# Altium schematic sheet Breeze2 ESC V1.SchDoc
size A2
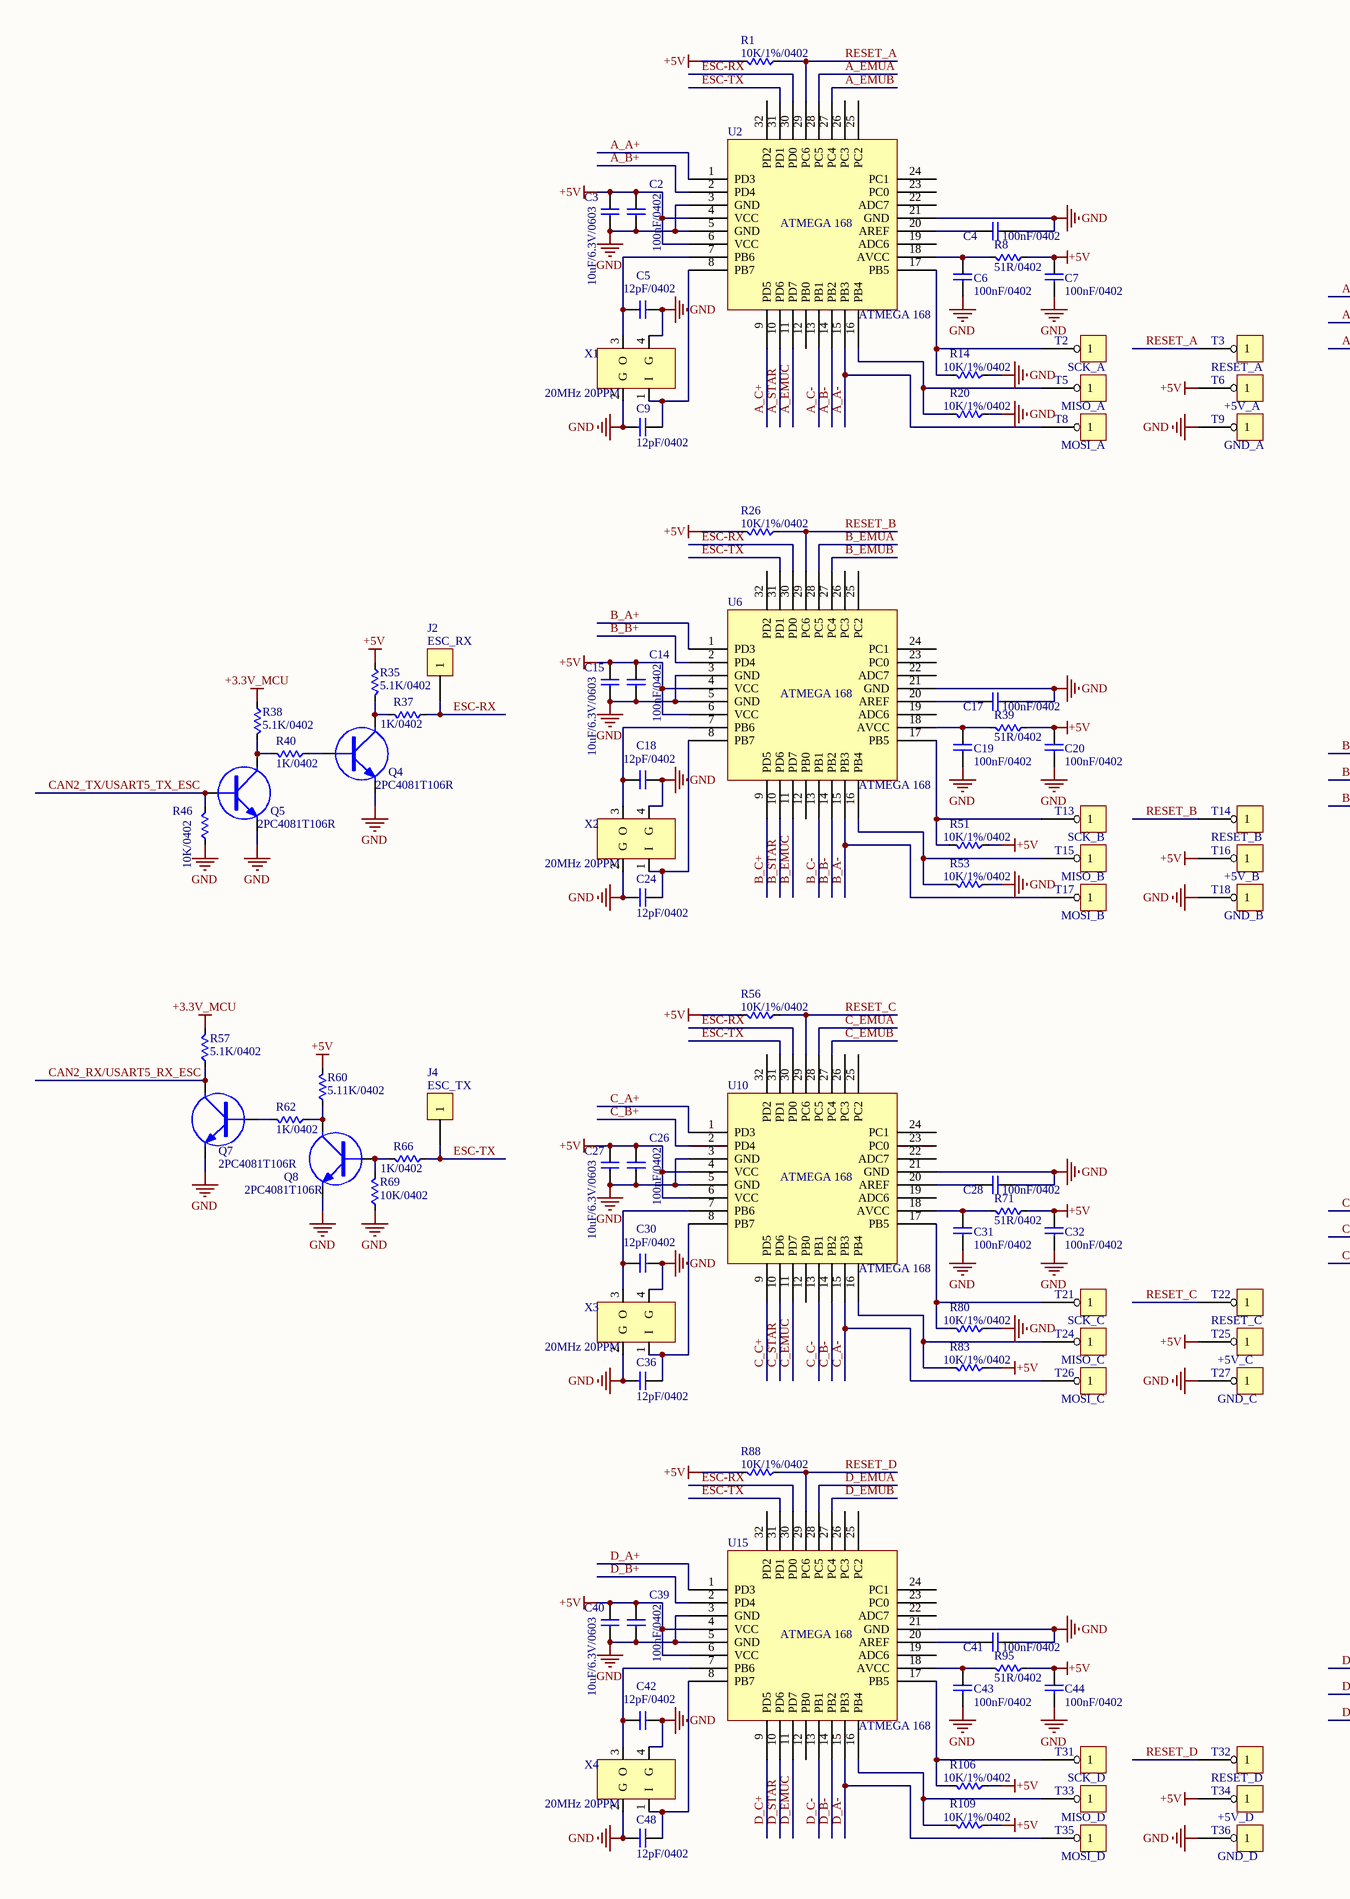
[diagram p0: Breeze2 ESC V1.SchDoc, left]
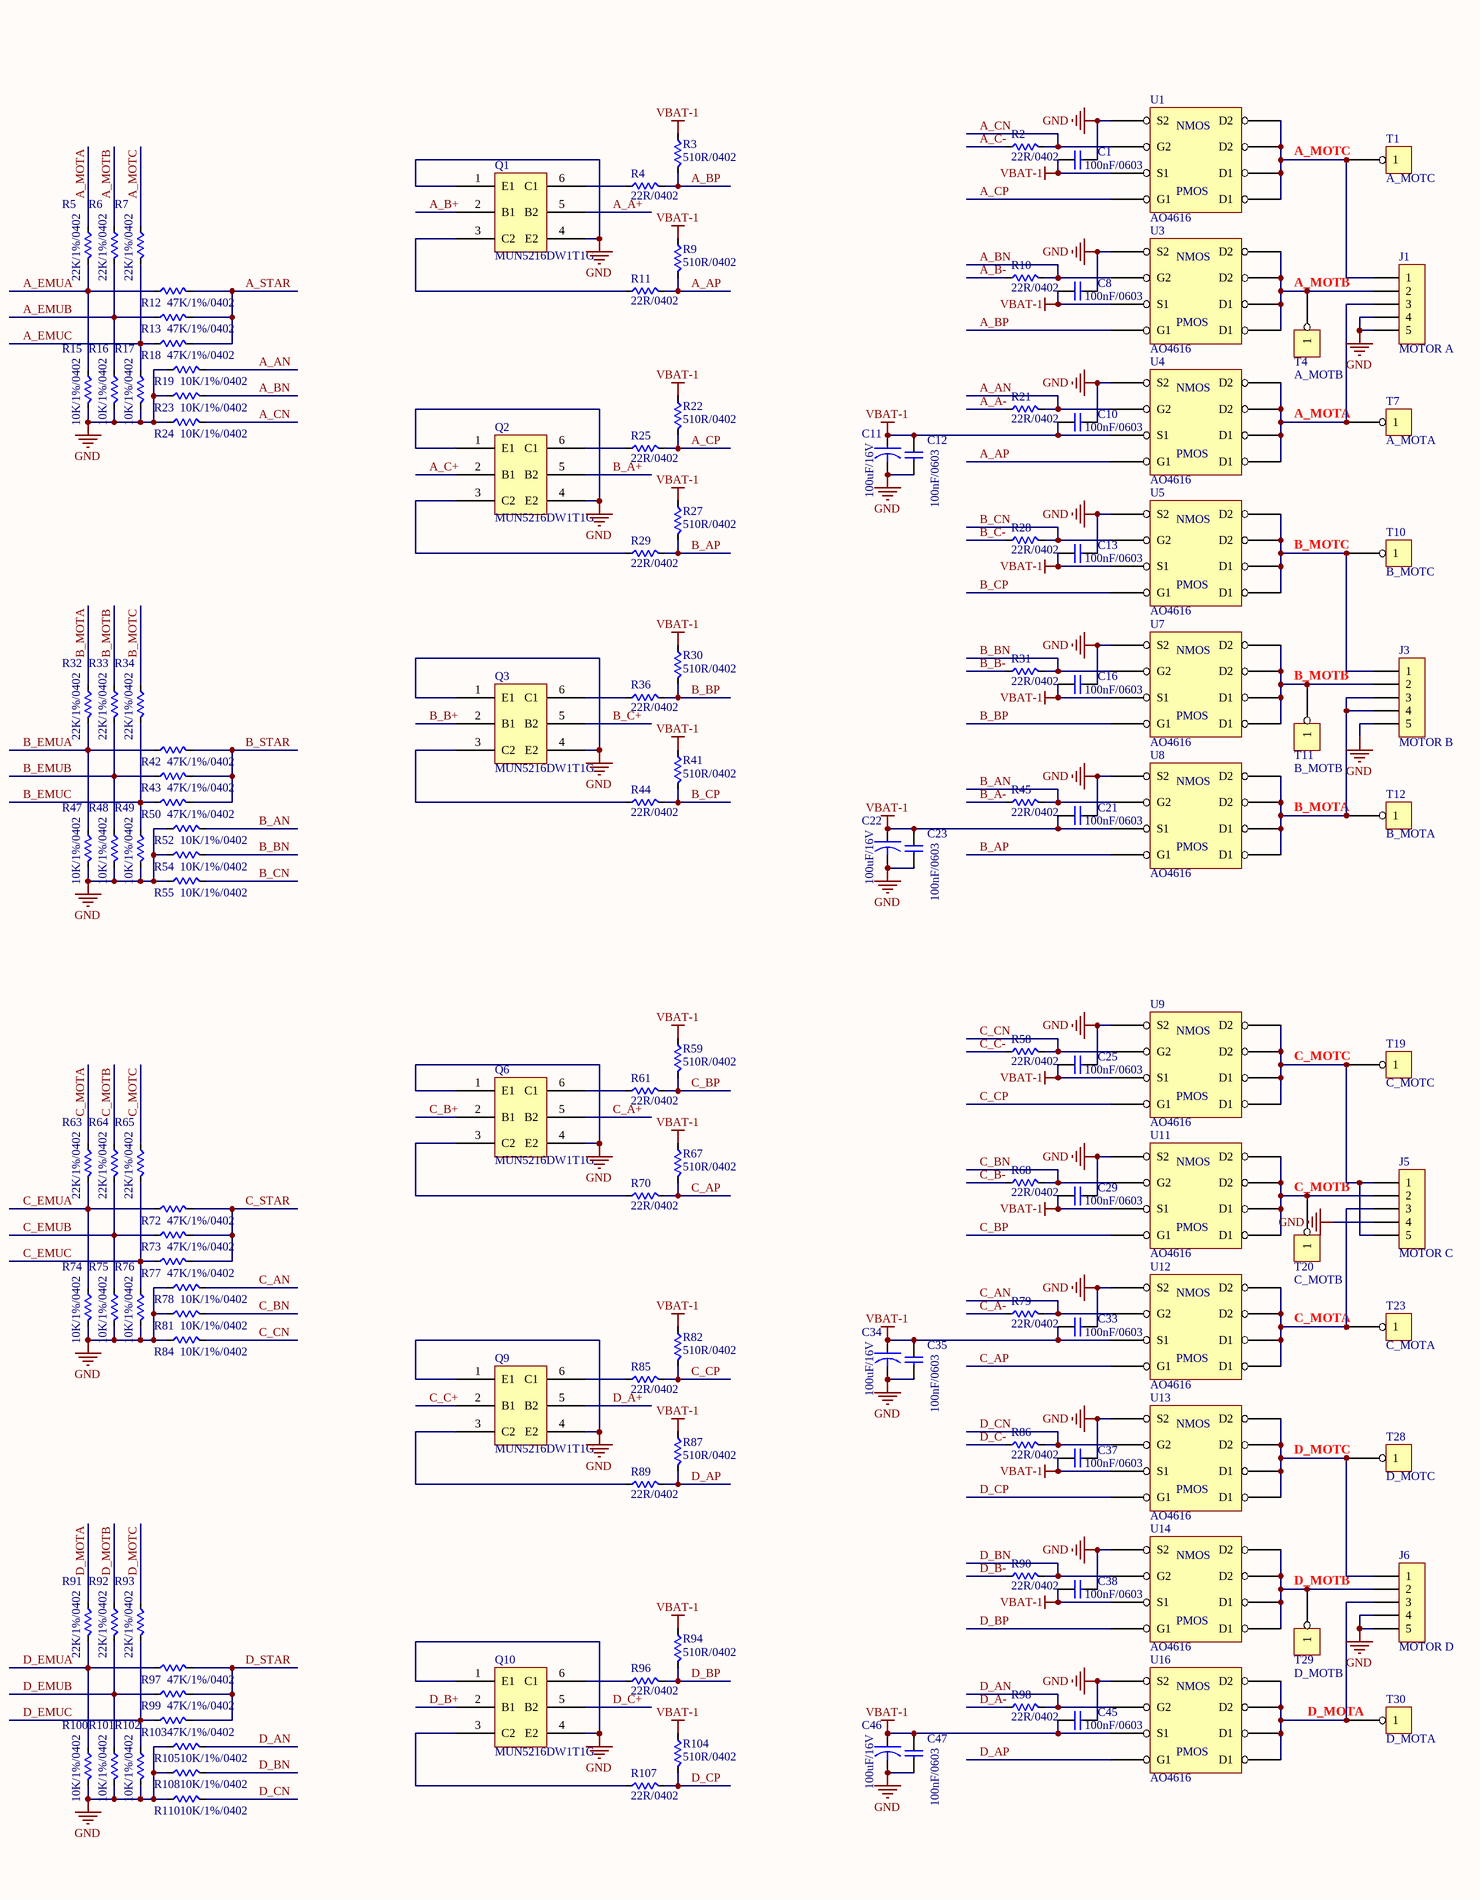
[diagram p1: Breeze2 ESC V1.SchDoc, right]

## Parts
C1  100nF/0603  [0603C-S]
C2  100nF/0402  [0402C-S]
C3  10uF/6.3V/0603  [0603C-S]
C4  100nF/0402  [0402C-S]
C5  12pF/0402  [0402C-S]
C6  100nF/0402  [0402C-S]
C7  100nF/0402  [0402C-S]
C8  100nF/0603  [0603C-S]
C9  12pF/0402  [0402C-S]
C10  100nF/0603  [0603C-S]
C11  100uF/16V  [1210C-S]
C12  100nF/0603  [0603C-S]
C13  100nF/0603  [0603C-S]
C14  100nF/0402  [0402C-S]
C15  10uF/6.3V/0603  [0603C-S]
C16  100nF/0603  [0603C-S]
C17  100nF/0402  [0402C-S]
C18  12pF/0402  [0402C-S]
C19  100nF/0402  [0402C-S]
C20  100nF/0402  [0402C-S]
C21  100nF/0603  [0603C-S]
C22  100uF/16V  [1210C-S]
C23  100nF/0603  [0603C-S]
C24  12pF/0402  [0402C-S]
C25  100nF/0603  [0603C-S]
C26  100nF/0402  [0402C-S]
C27  10uF/6.3V/0603  [0603C-S]
C28  100nF/0402  [0402C-S]
C29  100nF/0603  [0603C-S]
C30  12pF/0402  [0402C-S]
C31  100nF/0402  [0402C-S]
C32  100nF/0402  [0402C-S]
C33  100nF/0603  [0603C-S]
C34  100uF/16V  [1210C-S]
C35  100nF/0603  [0603C-S]
C36  12pF/0402  [0402C-S]
C37  100nF/0603  [0603C-S]
C38  100nF/0603  [0603C-S]
C39  100nF/0402  [0402C-S]
C40  10uF/6.3V/0603  [0603C-S]
C41  100nF/0402  [0402C-S]
C42  12pF/0402  [0402C-S]
C43  100nF/0402  [0402C-S]
C44  100nF/0402  [0402C-S]
C45  100nF/0603  [0603C-S]
C46  100uF/16V  [1210C-S]
C47  100nF/0603  [0603C-S]
C48  12pF/0402  [0402C-S]
J1  MOTOR A  [1.5*3PIN/SMD-H]
J2  ESC_RX  [TPJ1.2]
J3  MOTOR B  [1.5*3PIN/SMD-H]
J4  ESC_TX  [TPJ1.2]
J5  MOTOR C  [1.5*3PIN/SMD-H]
J6  MOTOR D  [1.5*3PIN/SMD-H]
Q1  MUN5216DW1T1G  [SOT-363A]
Q2  MUN5216DW1T1G  [SOT-363A]
Q3  MUN5216DW1T1G  [SOT-363A]
Q4  2PC4081T106R  [SOT-323A]
Q5  2PC4081T106R  [SOT-323A]
Q6  MUN5216DW1T1G  [SOT-363A]
Q7  2PC4081T106R  [SOT-323A]
Q8  2PC4081T106R  [SOT-323A]
Q9  MUN5216DW1T1G  [SOT-363A]
Q10  MUN5216DW1T1G  [SOT-363A]
R1  10K/1%/0402  [0402R-S]
R2  22R/0402  [0402R-S]
R3  510R/0402  [0402R-S]
R4  22R/0402  [0402R-S]
R5  22K/1%/0402  [0402R-S]
R6  22K/1%/0402  [0402R-S]
R7  22K/1%/0402  [0402R-S]
R8  51R/0402  [0402R-S]
R9  510R/0402  [0402R-S]
R10  22R/0402  [0402R-S]
R11  22R/0402  [0402R-S]
R12  47K/1%/0402  [0402R-S]
R13  47K/1%/0402  [0402R-S]
R14  10K/1%/0402  [0402R-S]
R15  10K/1%/0402  [0402R-S]
R16  10K/1%/0402  [0402R-S]
R17  10K/1%/0402  [0402R-S]
R18  47K/1%/0402  [0402R-S]
R19  10K/1%/0402  [0402R-S]
R20  10K/1%/0402  [0402R-S]
R21  22R/0402  [0402R-S]
R22  510R/0402  [0402R-S]
R23  10K/1%/0402  [0402R-S]
R24  10K/1%/0402  [0402R-S]
R25  22R/0402  [0402R-S]
R26  10K/1%/0402  [0402R-S]
R27  510R/0402  [0402R-S]
R28  22R/0402  [0402R-S]
R29  22R/0402  [0402R-S]
R30  510R/0402  [0402R-S]
R31  22R/0402  [0402R-S]
R32  22K/1%/0402  [0402R-S]
R33  22K/1%/0402  [0402R-S]
R34  22K/1%/0402  [0402R-S]
R35  5.1K/0402  [0402R-S]
R36  22R/0402  [0402R-S]
R37  1K/0402  [0402R-S]
R38  5.1K/0402  [0402R-S]
R39  51R/0402  [0402R-S]
R40  1K/0402  [0402R-S]
R41  510R/0402  [0402R-S]
R42  47K/1%/0402  [0402R-S]
R43  47K/1%/0402  [0402R-S]
R44  22R/0402  [0402R-S]
R45  22R/0402  [0402R-S]
R46  10K/0402  [0402R-S]
R47  10K/1%/0402  [0402R-S]
R48  10K/1%/0402  [0402R-S]
R49  10K/1%/0402  [0402R-S]
R50  47K/1%/0402  [0402R-S]
R51  10K/1%/0402  [0402R-S]
R52  10K/1%/0402  [0402R-S]
R53  10K/1%/0402  [0402R-S]
R54  10K/1%/0402  [0402R-S]
R55  10K/1%/0402  [0402R-S]
R56  10K/1%/0402  [0402R-S]
R57  5.1K/0402  [0402R-S]
R58  22R/0402  [0402R-S]
R59  510R/0402  [0402R-S]
R60  5.11K/0402  [0402R-S]
R61  22R/0402  [0402R-S]
R62  1K/0402  [0402R-S]
R63  22K/1%/0402  [0402R-S]
R64  22K/1%/0402  [0402R-S]
R65  22K/1%/0402  [0402R-S]
R66  1K/0402  [0402R-S]
R67  510R/0402  [0402R-S]
R68  22R/0402  [0402R-S]
R69  10K/0402  [0402R-S]
R70  22R/0402  [0402R-S]
R71  51R/0402  [0402R-S]
R72  47K/1%/0402  [0402R-S]
R73  47K/1%/0402  [0402R-S]
R74  10K/1%/0402  [0402R-S]
R75  10K/1%/0402  [0402R-S]
R76  10K/1%/0402  [0402R-S]
R77  47K/1%/0402  [0402R-S]
R78  10K/1%/0402  [0402R-S]
R79  22R/0402  [0402R-S]
R80  10K/1%/0402  [0402R-S]
R81  10K/1%/0402  [0402R-S]
R82  510R/0402  [0402R-S]
R83  10K/1%/0402  [0402R-S]
R84  10K/1%/0402  [0402R-S]
R85  22R/0402  [0402R-S]
R86  22R/0402  [0402R-S]
R87  510R/0402  [0402R-S]
R88  10K/1%/0402  [0402R-S]
R89  22R/0402  [0402R-S]
R90  22R/0402  [0402R-S]
R91  22K/1%/0402  [0402R-S]
R92  22K/1%/0402  [0402R-S]
R93  22K/1%/0402  [0402R-S]
R94  510R/0402  [0402R-S]
R95  51R/0402  [0402R-S]
R96  22R/0402  [0402R-S]
R97  47K/1%/0402  [0402R-S]
R98  22R/0402  [0402R-S]
R99  47K/1%/0402  [0402R-S]
R100  10K/1%/0402  [0402R-S]
R101  10K/1%/0402  [0402R-S]
R102  10K/1%/0402  [0402R-S]
R103  47K/1%/0402  [0402R-S]
R104  510R/0402  [0402R-S]
R105  10K/1%/0402  [0402R-S]
R106  10K/1%/0402  [0402R-S]
R107  22R/0402  [0402R-S]
R108  10K/1%/0402  [0402R-S]
R109  10K/1%/0402  [0402R-S]
R110  10K/1%/0402  [0402R-S]
T1  A_MOTC  [TPJ1.5]
T2  SCK_A  [TPJ1.2]
T3  RESET_A  [TPJ1.2]
T4  A_MOTB  [TPJ1.5]
T5  MISO_A  [TPJ1.2]
T6  +5V_A  [TPJ1.2]
T7  A_MOTA  [TPJ1.5]
T8  MOSI_A  [TPJ1.2]
T9  GND_A  [TPJ1.2]
T10  B_MOTC  [TPJ1.5]
T11  B_MOTB  [TPJ1.5]
T12  B_MOTA  [TPJ1.5]
T13  SCK_B  [TPJ1.2]
T14  RESET_B  [TPJ1.2]
T15  MISO_B  [TPJ1.2]
T16  +5V_B  [TPJ1.2]
T17  MOSI_B  [TPJ1.2]
T18  GND_B  [TPJ1.2]
T19  C_MOTC  [TPJ1.5]
T20  C_MOTB  [TPJ1.5]
T21  SCK_C  [TPJ1.2]
T22  RESET_C  [TPJ1.2]
T23  C_MOTA  [TPJ1.5]
T24  MISO_C  [TPJ1.2]
T25  +5V_C  [TPJ1.2]
T26  MOSI_C  [TPJ1.2]
T27  GND_C  [TPJ1.2]
T28  D_MOTC  [TPJ1.5]
T29  D_MOTB  [TPJ1.5]
T30  D_MOTA  [TPJ1.5]
T31  SCK_D  [TPJ1.2]
T32  RESET_D  [TPJ1.2]
T33  MISO_D  [TPJ1.2]
T34  +5V_D  [TPJ1.2]
T35  MOSI_D  [TPJ1.2]
T36  GND_D  [TPJ1.2]
U1  AO4616  [SO-8A]
U2  ATMEGA 168  [QFN32/5*5]
U3  AO4616  [SO-8A]
U4  AO4616  [SO-8A]
U5  AO4616  [SO-8A]
U6  ATMEGA 168  [QFN32/5*5]
U7  AO4616  [SO-8A]
U8  AO4616  [SO-8A]
U9  AO4616  [SO-8A]
U10  ATMEGA 168  [QFN32/5*5]
U11  AO4616  [SO-8A]
U12  AO4616  [SO-8A]
U13  AO4616  [SO-8A]
U14  AO4616  [SO-8A]
U15  ATMEGA 168  [QFN32/5*5]
U16  AO4616  [SO-8A]
X1  20MHz 20PPM  [Y3225]
X2  20MHz 20PPM  [Y3225]
X3  20MHz 20PPM  [Y3225]
X4  20MHz 20PPM  [Y3225]

## Nets
+3.3V_MCU: R38.2 R57.2
+5V: C2.1 C3.1 C7.1 C14.1 C15.1 C20.1 C26.1 C27.1 C32.1 C39.1 C40.1 C44.1 R1.2 R8.1 R26.2 R35.2 R39.1 R51.1 R56.2 R60.2 R71.1 R83.1 R88.2 R95.1 R106.1 R109.1 T6.1 T16.1 T25.1 T34.1 U2.4(VCC) U2.6(VCC) U6.4(VCC) U6.6(VCC) U10.4(VCC) U10.6(VCC) U15.4(VCC) U15.6(VCC)
GND: C1.2 C2.2 C3.2 C4.2 C5.2 C6.2 C7.2 C8.2 C9.2 C10.2 C11.2 C12.2 C13.2 C14.2 C15.2 C16.2 C17.2 C18.2 C19.2 C20.2 C21.2 C22.2 C23.2 C24.2 C25.2 C26.2 C27.2 C28.2 C29.2 C30.2 C31.2 C32.2 C33.2 C34.2 C35.2 C36.2 C37.2 C38.2 C39.2 C40.2 C41.2 C42.2 C43.2 C44.2 C45.2 C46.2 C47.2 C48.2 J1.4 J1.5 J3.5 J5.4 J6.4 J6.5 Q1.1(E1) Q1.4(E2) Q2.1(E1) Q2.4(E2) Q3.1(E1) Q3.4(E2) Q4.2(E) Q5.2(E) Q6.1(E1) Q6.4(E2) Q7.2(E) Q8.2(E) Q9.1(E1) Q9.4(E2) Q10.1(E1) Q10.4(E2) R14.1 R15.2 R16.2 R17.2 R19.1 R20.1 R23.1 R24.1 R46.1 R47.2 R48.2 R49.2 R52.1 R53.1 R54.1 R55.1 R69.1 R74.2 R75.2 R76.2 R78.1 R80.1 R81.1 R84.1 R100.2 R101.2 R102.2 R105.1 R108.1 R110.1 T9.1 T18.1 T27.1 T36.1 U1.1(S2) U2.3(GND) U2.5(GND) U2.21(GND) U3.1(S2) U4.1(S2) U5.1(S2) U6.3(GND) U6.5(GND) U6.21(GND) U7.1(S2) U8.1(S2) U9.1(S2) U10.3(GND) U10.5(GND) U10.21(GND) U11.1(S2) U12.1(S2) U13.1(S2) U14.1(S2) U15.3(GND) U15.5(GND) U15.21(GND) U16.1(S2) X1.2(G) X1.4(G) X2.2(G) X2.4(G) X3.2(G) X3.4(G) X4.2(G) X4.4(G)
VBAT-1: C1.1 C8.1 C10.1 C11.1 C12.1 C13.1 C16.1 C21.1 C22.1 C23.1 C25.1 C29.1 C33.1 C34.1 C35.1 C37.1 C38.1 C45.1 C46.1 C47.1 R3.1 R9.1 R22.1 R27.1 R30.1 R41.1 R59.1 R67.1 R82.1 R87.1 R94.1 R104.1 U1.3(S1) U3.3(S1) U4.3(S1) U5.3(S1) U7.3(S1) U8.3(S1) U9.3(S1) U11.3(S1) U12.3(S1) U13.3(S1) U14.3(S1) U16.3(S1)
A_A+: Q1.5(B2) U2.1(PD3)
A_A-: R21.1 T8.1 U2.15(PB3)
A_AN: R19.2 R21.2 U4.2(G2)
A_AP: R9.2 R11.2 U4.4(G1)
A_B+: Q1.2(B1) U2.2(PD4)
A_B-: R10.1 U2.14(PB2)
A_BN: R10.2 R23.2 U3.2(G2)
A_BP: R3.2 R4.2 U3.4(G1)
A_C+: Q2.2(B1) U2.9(PD5)
A_C-: R2.1 U2.13(PB1)
A_CN: R2.2 R24.2 U1.2(G2)
A_CP: R22.2 R25.2 U1.4(G1)
A_EMUA: R5.2 R12.1 R15.1 U2.28(PC5)
A_EMUB: R6.2 R13.1 R16.1 U2.27(PC4)
A_EMUC: R7.2 R17.1 R18.1 U2.11(PD7)
A_MOTA: J1.3 R5.1 T7.1 U4.5(D1) U4.6(D1) U4.7(D2) U4.8(D2)
A_MOTB: J1.2 R6.1 T4.1 U3.5(D1) U3.6(D1) U3.7(D2) U3.8(D2)
A_MOTC: J1.1 R7.1 T1.1 U1.5(D1) U1.6(D1) U1.7(D2) U1.8(D2)
A_STAR: R12.2 R13.2 R18.2 U2.10(PD6)
B_A+: Q2.5(B2) U6.1(PD3)
B_A-: R45.1 T17.1 U6.15(PB3)
B_AN: R45.2 R52.2 U8.2(G2)
B_AP: R27.2 R29.2 U8.4(G1)
B_B+: Q3.2(B1) U6.2(PD4)
B_B-: R31.1 U6.14(PB2)
B_BN: R31.2 R54.2 U7.2(G2)
B_BP: R30.2 R36.2 U7.4(G1)
B_C+: Q3.5(B2) U6.9(PD5)
B_C-: R28.1 U6.13(PB1)
B_CN: R28.2 R55.2 U5.2(G2)
B_CP: R41.2 R44.2 U5.4(G1)
B_EMUA: R32.2 R42.1 R47.1 U6.28(PC5)
B_EMUB: R33.2 R43.1 R48.1 U6.27(PC4)
B_EMUC: R34.2 R49.1 R50.1 U6.11(PD7)
B_MOTA: J3.3 J3.4 R32.1 T12.1 U8.5(D1) U8.6(D1) U8.7(D2) U8.8(D2)
B_MOTB: J3.2 R33.1 T11.1 U7.5(D1) U7.6(D1) U7.7(D2) U7.8(D2)
B_MOTC: J3.1 R34.1 T10.1 U5.5(D1) U5.6(D1) U5.7(D2) U5.8(D2)
B_STAR: R42.2 R43.2 R50.2 U6.10(PD6)
C_A+: Q6.5(B2) U10.1(PD3)
C_A-: R79.1 T26.1 U10.15(PB3)
C_AN: R78.2 R79.2 U12.2(G2)
C_AP: R67.2 R70.2 U12.4(G1)
C_B+: Q6.2(B1) U10.2(PD4)
C_B-: R68.1 U10.14(PB2)
C_BN: R68.2 R81.2 U11.2(G2)
C_BP: R59.2 R61.2 U11.4(G1)
C_C+: Q9.2(B1) U10.9(PD5)
C_C-: R58.1 U10.13(PB1)
C_CN: R58.2 R84.2 U9.2(G2)
C_CP: R82.2 R85.2 U9.4(G1)
C_EMUA: R63.2 R72.1 R74.1 U10.28(PC5)
C_EMUB: R64.2 R73.1 R75.1 U10.27(PC4)
C_EMUC: R65.2 R76.1 R77.1 U10.11(PD7)
C_MOTA: J5.3 R63.1 T23.1 U12.5(D1) U12.6(D1) U12.7(D2) U12.8(D2)
C_MOTB: J5.2 R64.1 T20.1 U11.5(D1) U11.6(D1) U11.7(D2) U11.8(D2)
C_MOTC: J5.1 J5.5 R65.1 T19.1 U9.5(D1) U9.6(D1) U9.7(D2) U9.8(D2)
C_STAR: R72.2 R73.2 R77.2 U10.10(PD6)
CAN2_RX/USART5_RX_ESC: Q7.3(C) R57.1
CAN2_TX/USART5_TX_ESC: Q5.1(B) R46.2
D_A+: Q9.5(B2) U15.1(PD3)
D_A-: R98.1 T35.1 U15.15(PB3)
D_AN: R98.2 R105.2 U16.2(G2)
D_AP: R87.2 R89.2 U16.4(G1)
D_B+: Q10.2(B1) U15.2(PD4)
D_B-: R90.1 U15.14(PB2)
D_BN: R90.2 R108.2 U14.2(G2)
D_BP: R94.2 R96.2 U14.4(G1)
D_C+: Q10.5(B2) U15.9(PD5)
D_C-: R86.1 U15.13(PB1)
D_CN: R86.2 R110.2 U13.2(G2)
D_CP: R104.2 R107.2 U13.4(G1)
D_EMUA: R91.2 R97.1 R100.1 U15.28(PC5)
D_EMUB: R92.2 R99.1 R101.1 U15.27(PC4)
D_EMUC: R93.2 R102.1 R103.1 U15.11(PD7)
D_MOTA: J6.3 R91.1 T30.1 U16.5(D1) U16.6(D1) U16.7(D2) U16.8(D2)
D_MOTB: J6.2 R92.1 T29.1 U14.5(D1) U14.6(D1) U14.7(D2) U14.8(D2)
D_MOTC: J6.1 R93.1 T28.1 U13.5(D1) U13.6(D1) U13.7(D2) U13.8(D2)
D_STAR: R97.2 R99.2 R103.2 U15.10(PD6)
ESC-RX: J2.1 R37.1 U2.30(PD0) U6.30(PD0) U10.30(PD0) U15.30(PD0)
ESC-TX: J4.1 R66.1 U2.31(PD1) U6.31(PD1) U10.31(PD1) U15.31(PD1)
RESET_A: R1.1 T3.1 U2.29(PC6)
RESET_B: R26.1 T14.1 U6.29(PC6)
RESET_C: R56.1 T22.1 U10.29(PC6)
RESET_D: R88.1 T32.1 U15.29(PC6)
NetC4_1: C4.1 U2.20(AREF)
NetC5_1: C5.1 U2.7(PB6) X1.3(O)
NetC6_1: C6.1 R8.2 U2.18(AVCC)
NetC9_1: C9.1 U2.8(PB7) X1.1(I)
NetC17_1: C17.1 U6.20(AREF)
NetC18_1: C18.1 U6.7(PB6) X2.3(O)
NetC19_1: C19.1 R39.2 U6.18(AVCC)
NetC24_1: C24.1 U6.8(PB7) X2.1(I)
NetC28_1: C28.1 U10.20(AREF)
NetC30_1: C30.1 U10.7(PB6) X3.3(O)
NetC31_1: C31.1 R71.2 U10.18(AVCC)
NetC36_1: C36.1 U10.8(PB7) X3.1(I)
NetC41_1: C41.1 U15.20(AREF)
NetC42_1: C42.1 U15.7(PB6) X4.3(O)
NetC43_1: C43.1 R95.2 U15.18(AVCC)
NetC48_1: C48.1 U15.8(PB7) X4.1(I)
NetQ1_3: Q1.3(C2) R11.1
NetQ1_6: Q1.6(C1) R4.1
NetQ2_3: Q2.3(C2) R29.1
NetQ2_6: Q2.6(C1) R25.1
NetQ3_3: Q3.3(C2) R44.1
NetQ3_6: Q3.6(C1) R36.1
NetQ4_1: Q4.1(B) R40.2
NetQ4_3: Q4.3(C) R35.1 R37.2
NetQ5_3: Q5.3(C) R38.1 R40.1
NetQ6_3: Q6.3(C2) R70.1
NetQ6_6: Q6.6(C1) R61.1
NetQ7_1: Q7.1(B) R62.2
NetQ8_1: Q8.1(B) R66.2 R69.2
NetQ8_3: Q8.3(C) R60.1 R62.1
NetQ9_3: Q9.3(C2) R89.1
NetQ9_6: Q9.6(C1) R85.1
NetQ10_3: Q10.3(C2) R107.1
NetQ10_6: Q10.6(C1) R96.1
NetR14_2: R14.2 T2.1 U2.17(PB5)
NetR20_2: R20.2 T5.1 U2.16(PB4)
NetR51_2: R51.2 T13.1 U6.17(PB5)
NetR53_2: R53.2 T15.1 U6.16(PB4)
NetR80_2: R80.2 T21.1 U10.17(PB5)
NetR83_2: R83.2 T24.1 U10.16(PB4)
NetR106_2: R106.2 T31.1 U15.17(PB5)
NetR109_2: R109.2 T33.1 U15.16(PB4)

Not connected (* = marked no-connect by the designer): U2 12(PB0) 19(ADC6) 22(ADC7) 23(PC0) 24(PC1) 25(PC2) 26(PC3) 32(PD2); U6 12(PB0) 19(ADC6) 22(ADC7) 23(PC0) 24(PC1) 25(PC2) 26(PC3) 32(PD2); U10 12(PB0) 19(ADC6) 22(ADC7) 23(PC0) 24(PC1) 25(PC2) 26(PC3) 32(PD2); U15 12(PB0) 19(ADC6) 22(ADC7) 23(PC0) 24(PC1) 25(PC2) 26(PC3) 32(PD2)

## Notes on the sheet
- (in symbol AO4616) NMOS; PMOS

## Library data of the parts
C1-C10 C12-C21 C23-C33 C35-C45 C47 C48 = CAP
C11 C22 C34 C46 = CAPACITOR
J1 J3 J5 J6 = CON5: Connector
J2 J4 = CON1: Connector
Q1-Q3 Q6 Q9 Q10 = NPN_6
Q4 Q5 Q7 Q8 = NPN: NPN Transistor
R1-R34 R36 R39 R41-R45 R47-R56 R58 R59 R61 R63-R65 R67 R68 R70-R110 = Res
R35 R37 R38 R40 R46 R57 R60 R62 R66 R69 = RES
T1-T36 = HEADER1: Text Field1: 20; Text Field2: 20
X1-X4 = CON4A_1: Text Field1: 60; Text Field2: 30